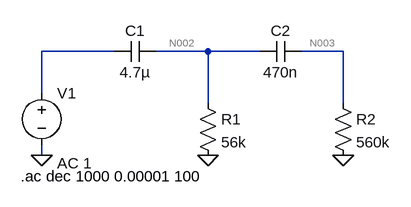
[diagram p0: schematic Pasa altos 2do orden.asc]
Pasa altos 2do orden.asc, the LTspice schematic file:
Version 4
SHEET 1 880 680
WIRE 32 96 -80 96
WIRE 176 96 96 96
WIRE 256 96 176 96
WIRE 384 96 320 96
WIRE -80 160 -80 96
WIRE 176 176 176 96
WIRE 384 176 384 96
WIRE -80 256 -80 240
FLAG 176 256 0
FLAG 384 256 0
FLAG -80 256 0
SYMBOL cap 96 80 R90
WINDOW 0 0 32 VBottom 2
WINDOW 3 32 32 VTop 2
SYMATTR InstName C1
SYMATTR Value 4.7µ
SYMBOL res 160 160 R0
SYMATTR InstName R1
SYMATTR Value 56k
SYMBOL cap 320 80 R90
WINDOW 0 0 32 VBottom 2
WINDOW 3 32 32 VTop 2
SYMATTR InstName C2
SYMATTR Value 470n
SYMBOL res 368 160 R0
SYMATTR InstName R2
SYMATTR Value 560k
SYMBOL voltage -80 144 R0
WINDOW 123 24 124 Left 2
WINDOW 39 0 0 Left 0
SYMATTR Value2 AC 1
SYMATTR InstName V1
SYMATTR Value ""
TEXT -112 288 Left 2 !.ac dec 1000 0.00001 100

The netlist it stands for:
* Pasa altos 2do orden.asc
C1 N002 N001 4.7µ
R1 N002 0 56k
C2 N003 N002 470n
R2 N003 0 560k
V1 N001 0 AC 1
.ac dec 1000 0.00001 100
.backanno
.end

* Results of the author's LTspice run, read from the files saved beside the schematic
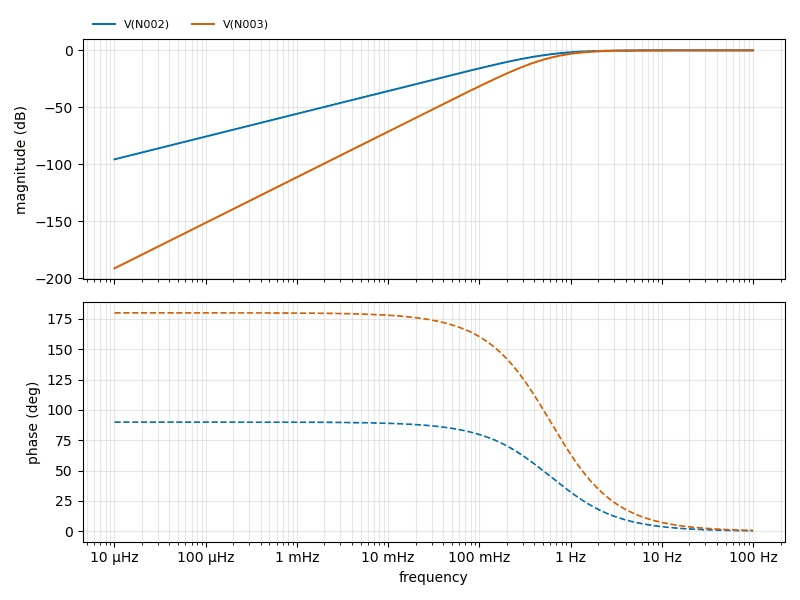
[diagram p1: AC Analysis of Pasa altos 2do orden.asc, plotted from the saved traces]
* AC Analysis, 1 run:
*   V(N002): -95.63 dB at 10 µHz, -0.00 dB at 100 Hz, peak -0.00 dB at 100 Hz, 3 dB below the peak at 669.5 mHz
*   V(N003): -191.26 dB at 10 µHz, -0.00 dB at 100 Hz, peak -0.00 dB at 100 Hz, 3 dB below the peak at 1.006 Hz